# Altium schematic sheet 04-SENSORS.SchDoc
size A4; DocumentNumber: 4; SheetNumber: 4; SheetTotal: 8
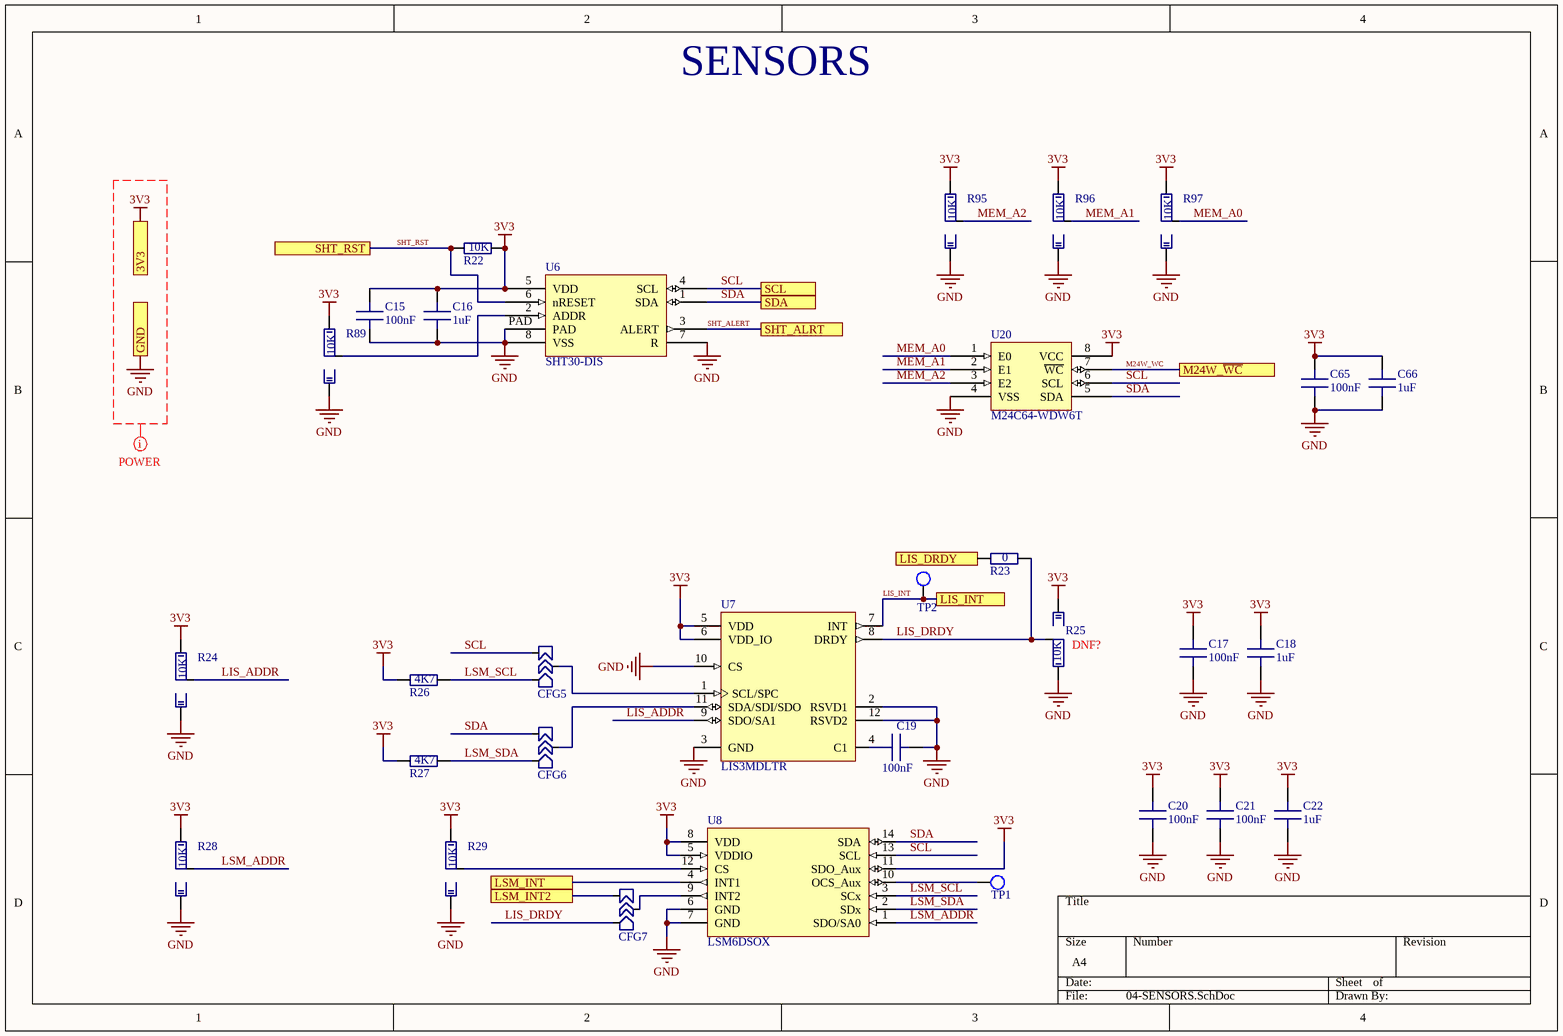
[diagram p0: 04-SENSORS.SchDoc]

## Parts
C15  100nF  [C0603]
C16  1uF  [C0805]
C17  100nF  [C0603]
C18  1uF  [C0805]
C19  100nF  [C0603]
C20  100nF  [C0603]
C21  100nF  [C0603]
C22  1uF  [C0805]
C65  100nF  [C0603]
C66  1uF  [C0805]
CFG5  CFG3_ORTH  [CFG_0603]  (value not drawn)  (no BOM)
CFG6  CFG3_ORTH  [CFG_0603]  (value not drawn)  (no BOM)
CFG7  CFG3_ORTH  [CFG_0603]  (value not drawn)  (no BOM)
R22  Resistance: 10K  [R0603]
R23  Resistance: 0  [R0603]
R24  Resistance: 10K  [RJ0603]
R25  Resistance: 10K  [RJ0603]
R26  Resistance: 4K7  [R0603]
R27  Resistance: 4K7  [R0603]
R28  Resistance: 10K  [RJ0603]
R29  Resistance: 10K  [RJ0603]
R89  Resistance: 10K  [RJ0603]
R95  Resistance: 10K  [RJ0603]
R96  Resistance: 10K  [RJ0603]
R97  Resistance: 10K  [RJ0603]
TP1  TEST_POINT  [TP_1mm]  (value not drawn)  (no BOM)
TP2  TEST_POINT  [TP_1mm]  (value not drawn)  (no BOM)
U6  SHT30-DIS  [SHT3X]
U7  LIS3MDLTR  [VFLGA-12]
U8  LSM6DSOX  [LGA-14L-PQFN50P250X300X86-14N]
U20  M24C64-WDW6T  [SO-8-SOIC127P600X175-8N]

## Ports
3V3, GND, LIS_DRDY, LIS_INT, LSM_INT, LSM_INT2, M24W_~{WC}, SCL, SDA, SHT_ALRT, SHT_RST

## Nets
3V3: C15.2 C16.2 C17.2 C18.2 C20.2 C21.2 C22.2 C65.2 C66.2 R22.2 R24.1 R25.3 R26.1 R27.1 R28.1 R29.1 R89.1 R95.1 R96.1 R97.1 U6.5(VDD) U7.5(VDD) U7.6(VDD_IO) U8.5(VDDIO) U8.8(VDD) U8.11(SDO_Aux) U20.8(VCC) ; port 3V3
GND: C15.1 C16.1 C17.1 C18.1 C19.2 C20.1 C21.1 C22.1 C65.1 C66.1 R24.3 R25.1 R28.3 R29.3 R89.3 R95.3 R96.3 R97.3 U6.7(R) U6.8(VSS) U6.PAD U7.2(RSVD1) U7.3(GND) U7.10(CS) U7.12(RSVD2) U8.6(GND) U8.7(GND) U20.4(VSS) ; port GND
LIS_ADDR: R24.2 U7.9(SDO/SA1)
LIS_DRDY: CFG7.3(B) R23.2 R25.2 U7.8(DRDY)
LIS_DRDY: R23.1 ; port LIS_DRDY  [a separate net that carries the same name]
LIS_INT: TP2.1 U7.7(INT) ; port LIS_INT
LSM_ADDR: R28.2 U8.1(SDO/SA0)
LSM_INT: U8.4(INT1) ; port LSM_INT
LSM_INT2: CFG7.1(A) ; port LSM_INT2
LSM_SCL: CFG5.3(B) R26.2 U8.3(SCx)
LSM_SDA: CFG6.3(B) R27.2 U8.2(SDx)
M24W_WC: U20.7(~{WC}) ; port M24W_~{WC}
MEM_A0: R97.2 U20.1(E0)
MEM_A1: R96.2 U20.2(E1)
MEM_A2: R95.2 U20.3(E2)
SCL: CFG5.1(A) U6.4(SCL) U8.13(SCL) U20.6(SCL) ; port SCL
SDA: CFG6.1(A) U6.1(SDA) U8.14(SDA) U20.5(SDA) ; port SDA
SHT_ALERT: U6.3(ALERT) ; port SHT_ALRT
SHT_RST: R22.1 U6.6(nRESET) ; port SHT_RST
NetC19_1: C19.1 U7.4(C1)
NetCFG5_2: CFG5.2(IN) U7.1(SCL/SPC)
NetCFG6_2: CFG6.2(IN) U7.11(SDA/SDI/SDO)
NetCFG7_2: CFG7.2(IN) U8.9(INT2)
NetR29_2: R29.2 U8.12(CS)
NetR89_2: R89.2 U6.2(ADDR)
NetTP1_1: TP1.1 U8.10(OCS_Aux)

## Layout directives
net class POWER_NET_CLASS: 3V3, GND

## Notes on the sheet
- SENSORS
- (near R25) DNF?

## Library data of the parts
C15 C17 C19-C21 C65 = C0603_100nF_16V: Ceramic capacitor; Voltage: 16V; Capacity: 100nF; Size: 0603; Value: 100nF; PriceKosmodromUAH: 1; Kosmodrom: http://www.kosmodrom.com.ua/el.php?name=CP06030.125V8020
C16 C18 C22 C66 = C0805_1uF_25V: Ceramic capacitor; Voltage: 25V; Capacity: 1uF; Size: 0805; Value: 1uF; PriceKosmodromUAH: 1; Kosmodrom: http://www.kosmodrom.com.ua/el.php?name=CP0805125V10
R22 = R0603_10K: Resistor General; Tolerance: 5%; Owned: 3000; Size: 0603; PriceRCSUAH: 0,06; RCS: https://www.rcscomponents.kiev.ua/product/10-kohm-5-0-1w-50v-0603-rc0603jr-0710kl-yageo_107096.html
R23 = R0603_0R: Resistor General; Tolerance: *; Size: 0603; PriceRCSUAH: 0,06; RCS: https://www.rcscomponents.kiev.ua/product/0-ohm-5-0-1w-50v-0603-rc0603jr-0r-hitano-rezistor-smd_4159.html
R24 R25 R28 R29 R89 R95-R97 = RJ0603_10K: Resistor General; Tolerance: 5%; Owned: 3000; Size: 0603; RCS: https://www.rcscomponents.kiev.ua/product/10-kohm-5-0-1w-50v-0603-rc0603jr-0710kl-yageo_107096.html; PriceRCSUAH: 0,06
R26 R27 = R0603_4K7: Resistor General; Tolerance: 5%; Owned: 3000; Size: 0603
U6 = SHT30-DIS: Temp & Humidity sensor; PriceKosmodromUAH: 75,75; Kosmodrom: http://www.kosmodrom.com.ua/el.php?name=SHT30-DIS-B
U7 = LIS3MDLTR: / LIS3MDL Series 3 Axis В±2/В±8/В±12/В±16 g 3.6V High Performance Magnetometer LGA-12 /; MF: STMicroelectronics; Package: VFLGA-12 STMicroelectronics; MP: LIS3MDLTR; Availability: Unavailable; Price: None; SnapEDA_Link: https://www.snapeda.com/parts/LIS3MDLTR/STMicroelectronics/view-part/?ref=snap; Value: *; PriceKosmodromUAH: 57,5; Kosmodrom: http://www.kosmodrom.com.ua/el.php?name=LIS3MDLTR
U8 = LSM6DSOX: Gygo and acceletometer programmable I2C master IC; Owned: 10; PriceDigiKey: 5,25; PriceMouser: 4,76; DigiKey: https://www.digikey.com/product-detail/en/stmicroelectronics/LSM6DSOXTR/497-18367-1-ND/9841887; Mouser: https://www.mouser.com/ProductDetail/STMicroelectronics/LSM6DSOXTR?qs=sGAEpiMZZMve4%2FbfQkoj%252BFvk5v0Gskwou%2F%2FEWTdvAK0%3D
U20 = M24C64-WDW6T: 64Kbit Serial I2C Bus EEPROM; Kosmodrom: *http://www.kosmodrom.com.ua/el.php?name=M24C64-WMN6TP; PriceUAH: -; PriceKosmodromUAH: 5